# Altium schematic sheet 7_LEDS.SchDoc: SmartHalo - Leds
size B; Author: Sébastien Gélinas; Organization: SmartHalo; Address1: 5445 de Gaspé; Address2: Montréal, QC; Address3: Canada; Address4: H2T 3B2; Revision: 1; SheetNumber: 7; SheetTotal: 7
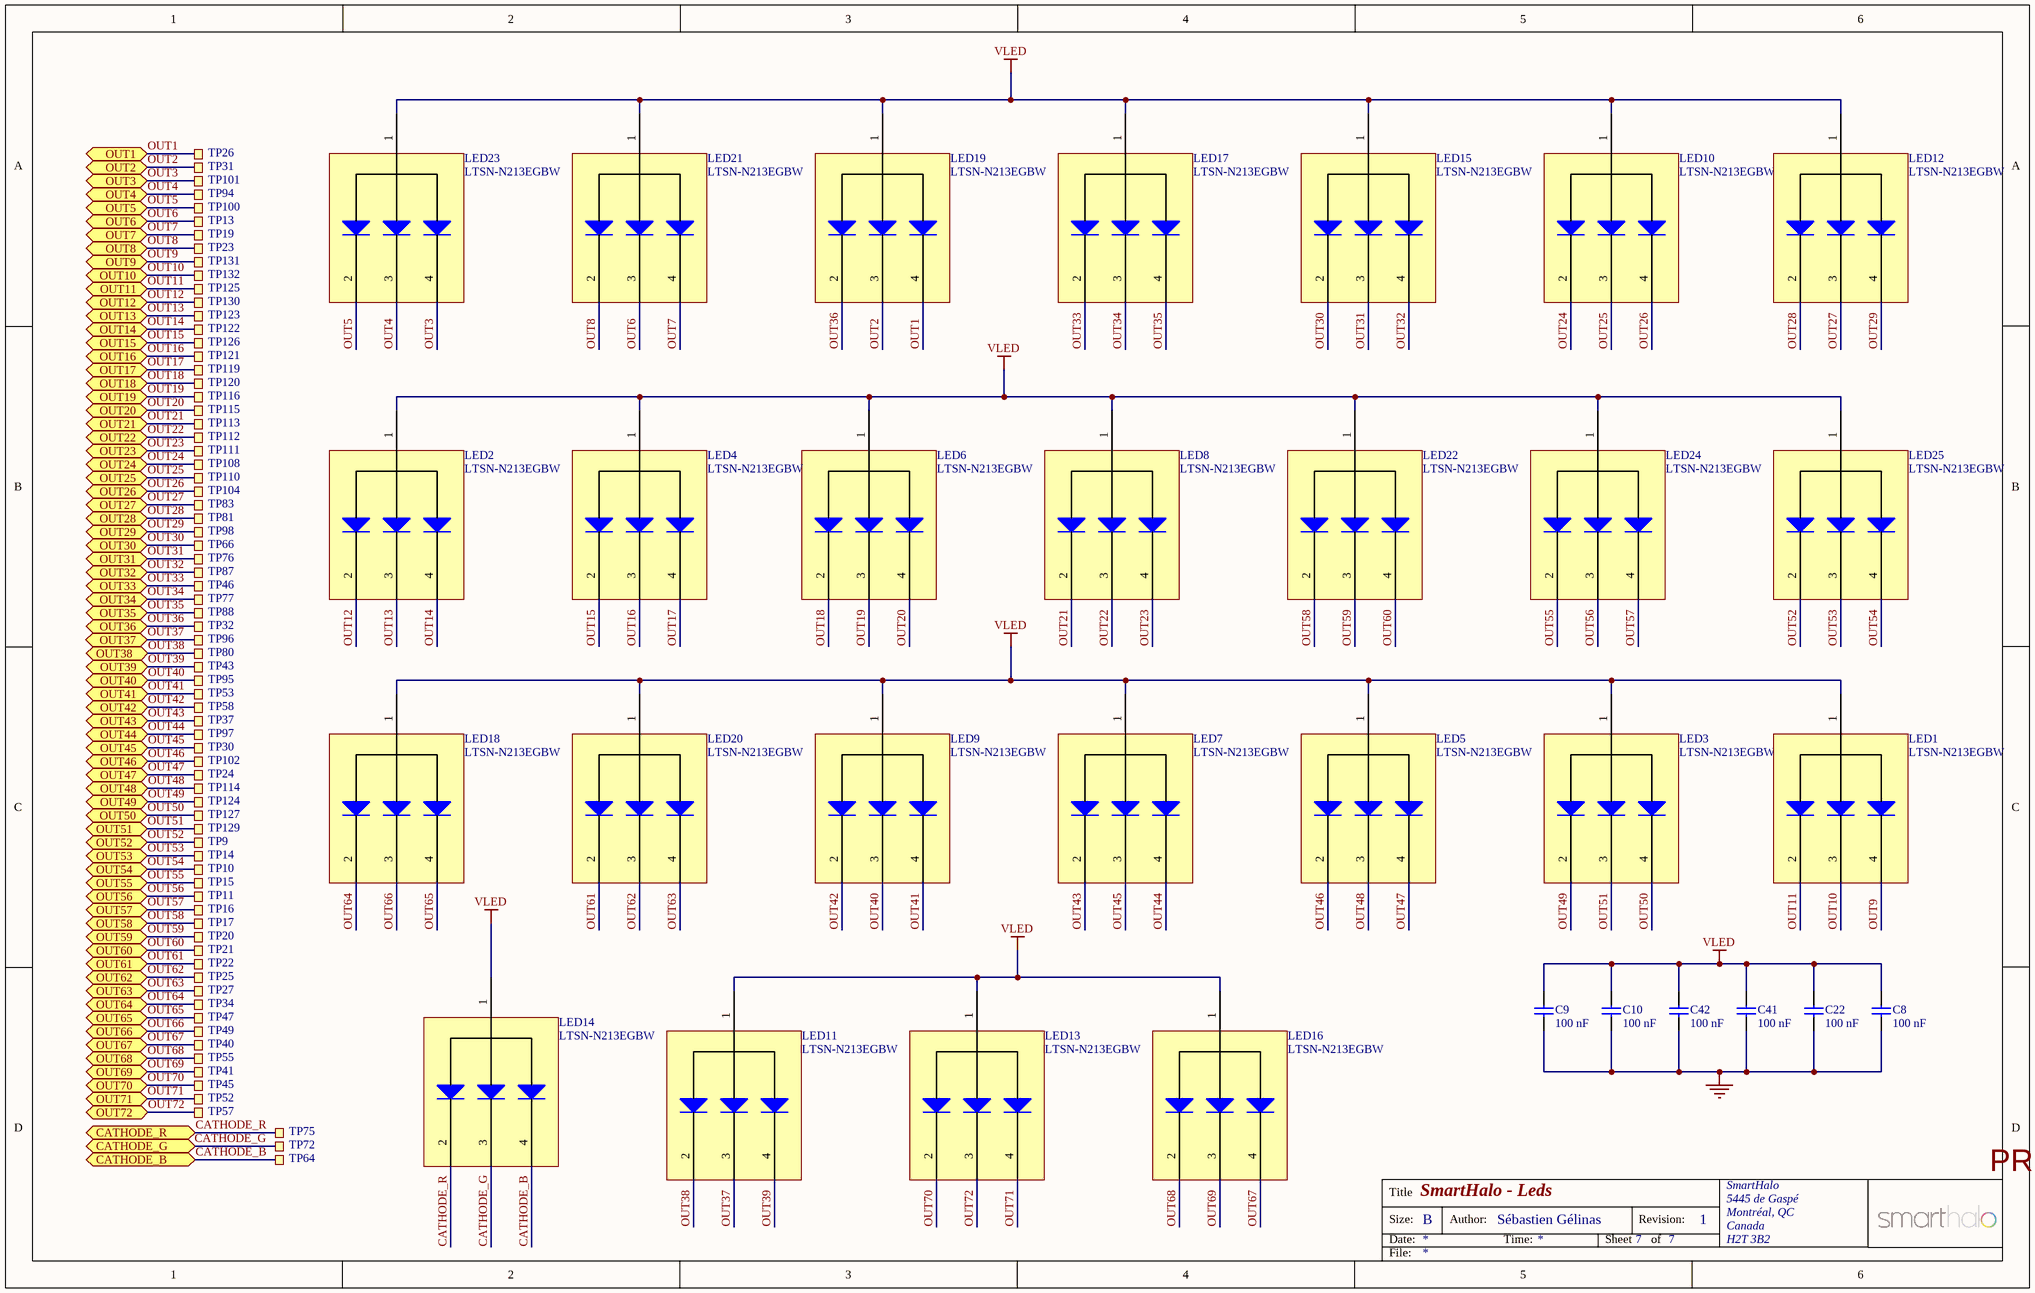
[diagram p0: 7_LEDS.SchDoc]

## Parts
C8  100 nF  [Varitron_CAP0402]
C9  100 nF  [Varitron_CAP0402]
C10  100 nF  [Varitron_CAP0402]
C22  100 nF  [Varitron_CAP0402]
C41  100 nF  [Varitron_CAP0402]
C42  100 nF  [Varitron_CAP0402]
LED1  LTSN-N213EGBW  [LTSN-N213EGBW]
LED2  LTSN-N213EGBW  [LTSN-N213EGBW]
LED3  LTSN-N213EGBW  [LTSN-N213EGBW]
LED4  LTSN-N213EGBW  [LTSN-N213EGBW]
LED5  LTSN-N213EGBW  [LTSN-N213EGBW]
LED6  LTSN-N213EGBW  [LTSN-N213EGBW]
LED7  LTSN-N213EGBW  [LTSN-N213EGBW]
LED8  LTSN-N213EGBW  [LTSN-N213EGBW]
LED9  LTSN-N213EGBW  [LTSN-N213EGBW]
LED10  LTSN-N213EGBW  [LTSN-N213EGBW]
LED11  LTSN-N213EGBW  [LTSN-N213EGBW]
LED12  LTSN-N213EGBW  [LTSN-N213EGBW]
LED13  LTSN-N213EGBW  [LTSN-N213EGBW]
LED14  LTSN-N213EGBW  [LTSN-N213EGBW]
LED15  LTSN-N213EGBW  [LTSN-N213EGBW]
LED16  LTSN-N213EGBW  [LTSN-N213EGBW]
LED17  LTSN-N213EGBW  [LTSN-N213EGBW]
LED18  LTSN-N213EGBW  [LTSN-N213EGBW]
LED19  LTSN-N213EGBW  [LTSN-N213EGBW]
LED20  LTSN-N213EGBW  [LTSN-N213EGBW]
LED21  LTSN-N213EGBW  [LTSN-N213EGBW]
LED22  LTSN-N213EGBW  [LTSN-N213EGBW]
LED23  LTSN-N213EGBW  [LTSN-N213EGBW]
LED24  LTSN-N213EGBW  [LTSN-N213EGBW]
LED25  LTSN-N213EGBW  [LTSN-N213EGBW]
TP9  (no value)  [TESTPAD-TH-35mils]  (no BOM)
TP10  (no value)  [TESTPAD-TH-35mils]  (no BOM)
TP11  (no value)  [TESTPAD-TH-35mils]  (no BOM)
TP13  (no value)  [TESTPAD-TH-35mils]  (no BOM)
TP14  (no value)  [TESTPAD-TH-35mils]  (no BOM)
TP15  (no value)  [TESTPAD-TH-35mils]  (no BOM)
TP16  (no value)  [TESTPAD-TH-35mils]  (no BOM)
TP17  (no value)  [TESTPAD-TH-35mils]  (no BOM)
TP19  (no value)  [TESTPAD-TH-35mils]  (no BOM)
TP20  (no value)  [TESTPAD-TH-35mils]  (no BOM)
TP21  (no value)  [TESTPAD-TH-35mils]  (no BOM)
TP22  (no value)  [TESTPAD-TH-35mils]  (no BOM)
TP23  (no value)  [TESTPAD-TH-35mils]  (no BOM)
TP24  (no value)  [TESTPAD-TH-35mils]  (no BOM)
TP25  (no value)  [TESTPAD-TH-35mils]  (no BOM)
TP26  (no value)  [TESTPAD-TH-35mils]  (no BOM)
TP27  (no value)  [TESTPAD-TH-35mils]  (no BOM)
TP30  (no value)  [TESTPAD-TH-35mils]  (no BOM)
TP31  (no value)  [TESTPAD-TH-35mils]  (no BOM)
TP32  (no value)  [TESTPAD-TH-35mils]  (no BOM)
TP34  (no value)  [TESTPAD-TH-35mils]  (no BOM)
TP37  (no value)  [TESTPAD-TH-35mils]  (no BOM)
TP40  (no value)  [TESTPAD-TH-35mils]  (no BOM)
TP41  (no value)  [TESTPAD-TH-35mils]  (no BOM)
TP43  (no value)  [TESTPAD-TH-35mils]  (no BOM)
TP45  (no value)  [TESTPAD-TH-35mils]  (no BOM)
TP46  (no value)  [TESTPAD-TH-35mils]  (no BOM)
TP47  (no value)  [TESTPAD-TH-35mils]  (no BOM)
TP49  (no value)  [TESTPAD-TH-35mils]  (no BOM)
TP52  (no value)  [TESTPAD-TH-35mils]  (no BOM)
TP53  (no value)  [TESTPAD-TH-35mils]  (no BOM)
TP55  (no value)  [TESTPAD-TH-35mils]  (no BOM)
TP57  (no value)  [TESTPAD-TH-35mils]  (no BOM)
TP58  (no value)  [TESTPAD-TH-35mils]  (no BOM)
TP64  (no value)  [TESTPAD-TH-35mils]  (no BOM)
TP66  (no value)  [TESTPAD-TH-35mils]  (no BOM)
TP72  (no value)  [TESTPAD-TH-35mils]  (no BOM)
TP75  (no value)  [TESTPAD-TH-35mils]  (no BOM)
TP76  (no value)  [TESTPAD-TH-35mils]  (no BOM)
TP77  (no value)  [TESTPAD-TH-35mils]  (no BOM)
TP80  (no value)  [TESTPAD-TH-35mils]  (no BOM)
TP81  (no value)  [TESTPAD-TH-35mils]  (no BOM)
TP83  (no value)  [TESTPAD-TH-35mils]  (no BOM)
TP87  (no value)  [TESTPAD-TH-35mils]  (no BOM)
TP88  (no value)  [TESTPAD-TH-35mils]  (no BOM)
TP94  (no value)  [TESTPAD-TH-35mils]  (no BOM)
TP95  (no value)  [TESTPAD-TH-35mils]  (no BOM)
TP96  (no value)  [TESTPAD-TH-35mils]  (no BOM)
TP97  (no value)  [TESTPAD-TH-35mils]  (no BOM)
TP98  (no value)  [TESTPAD-TH-35mils]  (no BOM)
TP100  (no value)  [TESTPAD-TH-35mils]  (no BOM)
TP101  (no value)  [TESTPAD-TH-35mils]  (no BOM)
TP102  (no value)  [TESTPAD-TH-35mils]  (no BOM)
TP104  (no value)  [TESTPAD-TH-35mils]  (no BOM)
TP108  (no value)  [TESTPAD-TH-35mils]  (no BOM)
TP110  (no value)  [TESTPAD-TH-35mils]  (no BOM)
TP111  (no value)  [TESTPAD-TH-35mils]  (no BOM)
TP112  (no value)  [TESTPAD-TH-35mils]  (no BOM)
TP113  (no value)  [TESTPAD-TH-35mils]  (no BOM)
TP114  (no value)  [TESTPAD-TH-35mils]  (no BOM)
TP115  (no value)  [TESTPAD-TH-35mils]  (no BOM)
TP116  (no value)  [TESTPAD-TH-35mils]  (no BOM)
TP119  (no value)  [TESTPAD-TH-35mils]  (no BOM)
TP120  (no value)  [TESTPAD-TH-35mils]  (no BOM)
TP121  (no value)  [TESTPAD-TH-35mils]  (no BOM)
TP122  (no value)  [TESTPAD-TH-35mils]  (no BOM)
TP123  (no value)  [TESTPAD-TH-35mils]  (no BOM)
TP124  (no value)  [TESTPAD-TH-35mils]  (no BOM)
TP125  (no value)  [TESTPAD-TH-35mils]  (no BOM)
TP126  (no value)  [TESTPAD-TH-35mils]  (no BOM)
TP127  (no value)  [TESTPAD-TH-35mils]  (no BOM)
TP129  (no value)  [TESTPAD-TH-35mils]  (no BOM)
TP130  (no value)  [TESTPAD-TH-35mils]  (no BOM)
TP131  (no value)  [TESTPAD-TH-35mils]  (no BOM)
TP132  (no value)  [TESTPAD-TH-35mils]  (no BOM)

## Ports
CATHODE_B, CATHODE_G, CATHODE_R, OUT1, OUT2, OUT3, OUT4, OUT5, OUT6, OUT7, OUT8, OUT9, OUT10, OUT11, OUT12, OUT13, OUT14, OUT15, OUT16, OUT17, OUT18, OUT19, OUT20, OUT21, OUT22, OUT23, OUT24, OUT25, OUT26, OUT27, OUT28, OUT29, OUT30, OUT31, OUT32, OUT33, OUT34, OUT35, OUT36, OUT37, OUT38, OUT39, OUT40, OUT41, OUT42, OUT43, OUT44, OUT45, OUT46, OUT47, OUT48, OUT49, OUT50, OUT51, OUT52, OUT53, OUT54, OUT55, OUT56, OUT57, OUT58, OUT59, OUT60, OUT61, OUT62, OUT63, OUT64, OUT65, OUT66, OUT67, OUT68, OUT69, OUT70, OUT71, OUT72

## Nets
GND: C8.2 C9.2 C10.2 C22.2 C41.2 C42.2
VLED: C8.1 C9.1 C10.1 C22.1 C41.1 C42.1 LED1.1(Anode) LED2.1(Anode) LED3.1(Anode) LED4.1(Anode) LED5.1(Anode) LED6.1(Anode) LED7.1(Anode) LED8.1(Anode) LED9.1(Anode) LED10.1(Anode) LED11.1(Anode) LED12.1(Anode) LED13.1(Anode) LED14.1(Anode) LED15.1(Anode) LED16.1(Anode) LED17.1(Anode) LED18.1(Anode) LED19.1(Anode) LED20.1(Anode) LED21.1(Anode) LED22.1(Anode) LED23.1(Anode) LED24.1(Anode) LED25.1(Anode)
CATHODE_B: LED14.4(Cathode_Blue) TP64.1 ; port CATHODE_B
CATHODE_G: LED14.3(Cathode_Green)
CATHODE_G: TP72.1 ; port CATHODE_G  [a separate net that carries the same name]
CATHODE_R: LED14.2(Cathode_Red) TP75.1 ; port CATHODE_R
OUT1: LED19.4(Cathode_Blue) TP26.1 ; port OUT1
OUT2: LED19.3(Cathode_Green) TP31.1 ; port OUT2
OUT3: LED23.4(Cathode_Blue) TP101.1 ; port OUT3
OUT4: LED23.3(Cathode_Green) TP94.1 ; port OUT4
OUT5: LED23.2(Cathode_Red) TP100.1 ; port OUT5
OUT6: LED21.3(Cathode_Green) TP13.1 ; port OUT6
OUT7: LED21.4(Cathode_Blue) TP19.1 ; port OUT7
OUT8: LED21.2(Cathode_Red) TP23.1 ; port OUT8
OUT9: LED1.4(Cathode_Blue) TP131.1 ; port OUT9
OUT10: LED1.3(Cathode_Green) TP132.1 ; port OUT10
OUT11: LED1.2(Cathode_Red) TP125.1 ; port OUT11
OUT12: LED2.2(Cathode_Red) TP130.1 ; port OUT12
OUT13: LED2.3(Cathode_Green) TP123.1 ; port OUT13
OUT14: LED2.4(Cathode_Blue) TP122.1 ; port OUT14
OUT15: LED4.2(Cathode_Red) TP126.1 ; port OUT15
OUT16: LED4.3(Cathode_Green) TP121.1 ; port OUT16
OUT17: LED4.4(Cathode_Blue) TP119.1 ; port OUT17
OUT18: LED6.2(Cathode_Red) TP120.1 ; port OUT18
OUT19: LED6.3(Cathode_Green) TP116.1 ; port OUT19
OUT20: LED6.4(Cathode_Blue) TP115.1 ; port OUT20
OUT21: LED8.2(Cathode_Red) TP113.1 ; port OUT21
OUT22: LED8.3(Cathode_Green) TP112.1 ; port OUT22
OUT23: LED8.4(Cathode_Blue) TP111.1 ; port OUT23
OUT24: LED10.2(Cathode_Red) TP108.1 ; port OUT24
OUT25: LED10.3(Cathode_Green) TP110.1 ; port OUT25
OUT26: LED10.4(Cathode_Blue) TP104.1 ; port OUT26
OUT27: LED12.3(Cathode_Green) TP83.1 ; port OUT27
OUT28: LED12.2(Cathode_Red) TP81.1 ; port OUT28
OUT29: LED12.4(Cathode_Blue) TP98.1 ; port OUT29
OUT30: LED15.2(Cathode_Red) TP66.1 ; port OUT30
OUT31: LED15.3(Cathode_Green) TP76.1 ; port OUT31
OUT32: LED15.4(Cathode_Blue) TP87.1 ; port OUT32
OUT33: LED17.2(Cathode_Red) TP46.1 ; port OUT33
OUT34: LED17.3(Cathode_Green) TP77.1 ; port OUT34
OUT35: LED17.4(Cathode_Blue) TP88.1 ; port OUT35
OUT36: LED19.2(Cathode_Red) TP32.1 ; port OUT36
OUT37: LED11.3(Cathode_Green) TP96.1 ; port OUT37
OUT38: LED11.2(Cathode_Red) TP80.1 ; port OUT38
OUT39: LED11.4(Cathode_Blue) TP43.1 ; port OUT39
OUT40: LED9.3(Cathode_Green) TP95.1 ; port OUT40
OUT41: LED9.4(Cathode_Blue) TP53.1 ; port OUT41
OUT42: LED9.2(Cathode_Red) TP58.1 ; port OUT42
OUT43: LED7.2(Cathode_Red) TP37.1 ; port OUT43
OUT44: LED7.4(Cathode_Blue) TP97.1 ; port OUT44
OUT45: LED7.3(Cathode_Green) TP30.1 ; port OUT45
OUT46: LED5.2(Cathode_Red) TP102.1 ; port OUT46
OUT47: LED5.4(Cathode_Blue) TP24.1 ; port OUT47
OUT48: LED5.3(Cathode_Green) TP114.1 ; port OUT48
OUT49: LED3.2(Cathode_Red) TP124.1 ; port OUT49
OUT50: LED3.4(Cathode_Blue) TP127.1 ; port OUT50
OUT51: LED3.3(Cathode_Green) TP129.1 ; port OUT51
OUT52: LED25.2(Cathode_Red) TP9.1 ; port OUT52
OUT53: LED25.3(Cathode_Green) TP14.1 ; port OUT53
OUT54: LED25.4(Cathode_Blue) TP10.1 ; port OUT54
OUT55: LED24.2(Cathode_Red) TP15.1 ; port OUT55
OUT56: LED24.3(Cathode_Green) TP11.1 ; port OUT56
OUT57: LED24.4(Cathode_Blue) TP16.1 ; port OUT57
OUT58: LED22.2(Cathode_Red) TP17.1 ; port OUT58
OUT59: LED22.3(Cathode_Green) TP20.1 ; port OUT59
OUT60: LED22.4(Cathode_Blue) TP21.1 ; port OUT60
OUT61: LED20.2(Cathode_Red) TP22.1 ; port OUT61
OUT62: LED20.3(Cathode_Green) TP25.1 ; port OUT62
OUT63: LED20.4(Cathode_Blue) TP27.1 ; port OUT63
OUT64: LED18.2(Cathode_Red) TP34.1 ; port OUT64
OUT65: LED18.4(Cathode_Blue) TP47.1 ; port OUT65
OUT66: LED18.3(Cathode_Green) TP49.1 ; port OUT66
OUT67: LED16.4(Cathode_Blue) TP40.1 ; port OUT67
OUT68: LED16.2(Cathode_Red) TP55.1 ; port OUT68
OUT69: LED16.3(Cathode_Green) TP41.1 ; port OUT69
OUT70: LED13.2(Cathode_Red) TP45.1 ; port OUT70
OUT71: LED13.4(Cathode_Blue) TP52.1 ; port OUT71
OUT72: LED13.3(Cathode_Green) TP57.1 ; port OUT72

## Notes on the sheet
- PRELIMINARY: DO NOT USE FOR PRODUCTION
- Labels drawn without touching a wire or pin: CATHODE_G
- Title
- Size:
- Date:
- B
- Author:
- Time:
- Sheet
- Revision:
- of
- File:

## Library data of the parts
C8-C10 C22 C41 C42 = Varitron_CAP0402: 100 nF 10V X7R 10% 0402 (1005 Metric)  SMD; Case-EIA: 0402; Case-Metric: 1005; Tolerance: 10%; Technology: SMT; Temperature Coefficient: X7R; Voltage Rating: 10V; Value: 100 nF
LED1-LED25 = LTSN-N213EGBW: LED SMD LTSN-N213EGBW; Manufacturer: LiteOn; Manufacturer Part Number: LTSN-N213EGBW; Part Number: LTSN-N213EGBW
TP9-TP11 TP13-TP17 TP19-TP27 TP30-TP32 TP34 TP37 TP40 TP41 TP43 TP45-TP47 TP49 TP52 TP53 TP55 TP57 TP58 TP64 TP66 TP72 TP75-TP77 TP80 TP81 TP83 TP87 TP88 TP94-TP98 TP100-TP102 TP104 TP108 TP110-TP116 TP119-TP127 TP129-TP132 = TESTPAD_TH_35mils: Testpoint, through hole, 35 mils; Value: TP